# Altium project BHI_EVAL.PrjPcb
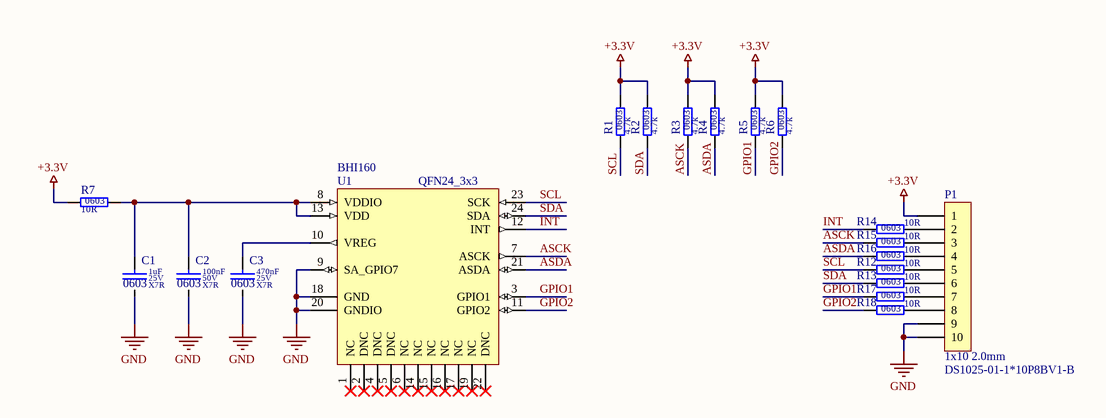
[diagram p0: BHI_EVAL.SchDoc]
1 sheet, 19 parts. Net scope: global (net labels, ports and power ports of the same name join across sheets).
Board file: BHI_EVAL.PcbDoc

## Sheet BHI_EVAL.SchDoc
size A4

### Parts
C1  value 1uF  Dielectric: X7R  Voltage: 25V  SCH_Footprint: 0603  [C_0603_1608]  (hidden comment: Ceramic X7R)
C2  value 100nF  Dielectric: X7R  Voltage: 50V  SCH_Footprint: 0603  [C_0603_1608]  (hidden comment: Ceramic X7R)
C3  value 470nF  Dielectric: X7R  Voltage: 25V  SCH_Footprint: 0603  [C_0603_1608]  (hidden comment: Ceramic X7R)
P1  value DS1025-01-1*10P8BV1-B  SCH_Footprint: 1x10 2.0mm  [P_HEADER_1x10_2.0]  (hidden comment: Goldpin)
R1  value 4.7k  SCH_Footprint: 0603  [R_0603_1608]  (hidden comment: Resistor)
R2  value 4.7k  SCH_Footprint: 0603  [R_0603_1608]  (hidden comment: Resistor)
R3  value 4.7k  SCH_Footprint: 0603  [R_0603_1608]  (hidden comment: Resistor)
R4  value 4.7k  SCH_Footprint: 0603  [R_0603_1608]  (hidden comment: Resistor)
R5  value 4.7k  SCH_Footprint: 0603  [R_0603_1608]  (hidden comment: Resistor)
R6  value 4.7k  SCH_Footprint: 0603  [R_0603_1608]  (hidden comment: Resistor)
R7  value 10R  SCH_Footprint: 0603  [R_0603_1608]  (hidden comment: Resistor)
R12  value 10R  SCH_Footprint: 0603  [R_0603_1608]  (hidden comment: Resistor)
R13  value 10R  SCH_Footprint: 0603  [R_0603_1608]  (hidden comment: Resistor)
R14  value 10R  SCH_Footprint: 0603  [R_0603_1608]  (hidden comment: Resistor)
R15  value 10R  SCH_Footprint: 0603  [R_0603_1608]  (hidden comment: Resistor)
R16  value 10R  SCH_Footprint: 0603  [R_0603_1608]  (hidden comment: Resistor)
R17  value 10R  SCH_Footprint: 0603  [R_0603_1608]  (hidden comment: Resistor)
R18  value 10R  SCH_Footprint: 0603  [R_0603_1608]  (hidden comment: Resistor)
U1  value BHI160  [QFN24_3x3]  (hidden comment: Three Axis Ultra Low Power Sensor Hub - LGA-24)

### Nets
+3.3V: P1.1 R1.2 R2.2 R3.2 R4.2 R5.2 R6.2 R7.1
GND: C1.2 C2.2 C3.2 P1.9 P1.10 U1.9(SA_GPIO7) U1.18(GND) U1.20(GNDIO)
ASCK: R3.1 R15.1 U1.7(ASCK)
ASDA: R4.1 R16.1 U1.21(ASDA)
GPIO1: R5.1 R17.1 U1.3(GPIO1)
GPIO2: R6.1 R18.1 U1.11(GPIO2)
INT: R14.1 U1.12(INT)
SCL: R1.1 R12.1 U1.23(SCK)
SDA: R2.1 R13.1 U1.24(SDA)
NetC1_1: C1.1 C2.1 R7.2 U1.8(VDDIO) U1.13(VDD)
NetC3_1: C3.1 U1.10(VREG)
NetP1_2: P1.2 R14.2
NetP1_3: P1.3 R15.2
NetP1_4: P1.4 R16.2
NetP1_5: P1.5 R12.2
NetP1_6: P1.6 R13.2
NetP1_7: P1.7 R17.2
NetP1_8: P1.8 R18.2

Not connected (* = marked no-connect by the designer): U1 1(NC)* 2(DNC)* 4(DNC)* 5(DNC)* 6(NC)* 14(NC)* 15(NC)* 16(NC)* 17(NC)* 19(NC)* 22(DNC)*

### Library data of the parts
C1 = C_1uF_25V_X7R_0603_10: Capacitor; Manufacturer: Samsung; Manufacturer Part Number: CL10B105KA8NNNC; Tolerance (%): 10; Part Number: C_1uF_25V_X7R_0603_10; HelpURL: http://www.tme.eu/pl/Document/4a42202b32dab16128fe107dd69598cc/samsung-chip-cap.pdf; Supplier 1: TME; Supplier Part Number 1: CL10B105KA8NNNC; Supplier 2: RS Components; Supplier 3: Farnell; Supplier 4: Mouser; Supplier 5: Digi-Key
C2 = C_100nF_50V_X7R_0603_5: Capacitor; Manufacturer: Samsung; Manufacturer Part Number: CL10B104JB8NNNC; Tolerance (%): 5; Part Number: C_100nF_50V_X7R_0603_5; HelpURL: http://www.tme.eu/pl/Document/4a42202b32dab16128fe107dd69598cc/samsung-chip-cap.pdf; Supplier 1: TME; Supplier Part Number 1: CL10B104JB8NNNC; Supplier 2: RS Components; Supplier 3: Farnell; Supplier 4: Mouser; Supplier 5: Digi-Key
C3 = C_470nF_25V_X7R_0603_10: Capacitor; Manufacturer: Murata; Manufacturer Part Number: GRM188R71E474KA12D; Tolerance (%): 10; Part Number: C_470nF_25V_X7R_0603_10; HelpURL: http://www.farnell.com/datasheets/2048708.pdf; Supplier 1: TME; Supplier 2: RS Components; Supplier Part Number 2: 7235654; Supplier 3: Farnell; Supplier Part Number 3: 1828901; Supplier 4: Mouser; Supplier Part Number 4: 81-GRM188R71E474KA12; Supplier 5: Digi-Key; Supplier Part Number 5: 490-3291-1-ND
P1 = P_HEADER_1x10_2.0: Pin Header; Manufacturer: Connfly; Part Number: P_HEADER_1x10_2.0; HelpURL: http://datasheet.octopart.com/DS1025-01-1%2A10P8BV1-B-Connfly-datasheet-81854023.pdf; Manufacturer Part Number: DS1025-01-1*10P8BV1-B; Supplier 1: TME; Supplier Part Number 1: ZL303-10P; Supplier 2: RS Components; Supplier 3: Farnell; Supplier 4: Mouser; Supplier 5: Digi-Key; Supplier 6: LCSC
R1-R6 = R_4.7k_0603_1: Manufacturer: Yageo; Manufacturer Part Number: RC0603FR-074K7L; Voltage: 75V; Power: 100mW; Tolerance: 1%; Part Number: R_4.7k_0603_1; HelpURL: http://www.farnell.com/datasheets/2167052.pdf?_ga=2.156163131.1690599162.1548417389-1379097396.1542296996&_gac=1.18389067.1547230258.Cj0KCQiAmuHhBRD0ARIsAFWyPwhX8HcvXnM3tA0ZBodZLzDIjH2ZxLpjT5LWo9bad_HPRbU8LfPq44UaAhEwEALw_wcB; Supplier 1: TME; Supplier Part Number 1: RC0603FR-074K7; Supplier 2: RS Components; Supplier 3: Farnell; Supplier Part Number 3: 9238565; Supplier 4: Mouser; Supplier Part Number 4: 603-RC0603FR-074K7L; Supplier 5: Digi-Key; Supplier Part Number 5: 311-4.70KHRCT-ND; Supplier 6: LCSC
R7 R12-R18 = R_10R_0603_1: Manufacturer: Royalohm; Manufacturer Part Number: 0603SAF100JT5E; Voltage: 50V; Power: 100mW; Tolerance: 1%; Part Number: R_10R_0603_1; HelpURL: http://www.tme.eu/pl/Document/b315665a56acbc42df513c99b390ad98/ROYALOHM-THICKFILM.pdf; Supplier 1: TME; Supplier Part Number 1: SMD0603-10R-1%; Supplier 2: RS Components; Supplier 3: Farnell; Supplier 4: Mouser; Supplier 5: Digi-Key
  R12-R18: Supplier 6: LCSC
U1 = U_BHI160: Manufacturer: Bosch Tools; SCH_Footprint: QFN24_3x3; Part Number: U_BHI160; HelpURL: https://datasheet.octopart.com/BHI160-Bosch-datasheet-66132459.pdf; Manufacturer Part Number: BHI160; Supplier 1: TME; Supplier 2: RS Components; Supplier 3: Farnell; Supplier 4: Mouser; Supplier Part Number 4: 262-BHI160; Supplier 5: Digi-Key; Supplier Part Number 5: 828-1067-1-ND